# Altium project power.PrjPcb
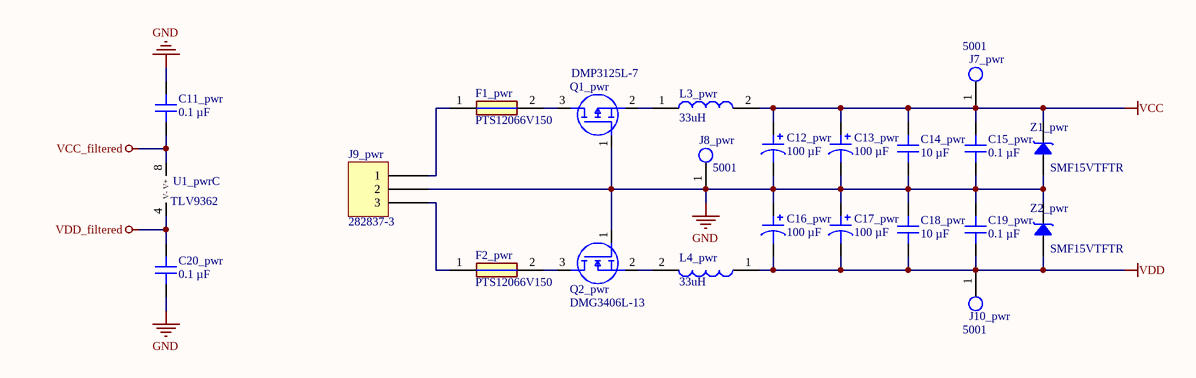
[diagram p0: misc.SchDoc]
2 sheets, 57 parts. Net scope: global (net labels, ports and power ports of the same name join across sheets).
Board file: power.PcbDoc
Sheets:
  misc.SchDoc
  LDO.SchDoc

## Sheet misc.SchDoc
size 381 x 241 mm; SheetNumber: 1; SheetTotal: 2

### Parts
C11_pwr  0.1 µF  [CAP 1206_3216 - 0.8MM]
C12_pwr  100 µF  [CAP ALSMD 8.3MM H10.5MM]
C13_pwr  100 µF  [CAP ALSMD 8.3MM H10.5MM]
C14_pwr  10 µF  [CAP 1206_3216 - 0.8MM]
C15_pwr  0.1 µF  [CAP 1206_3216 - 0.8MM]
C16_pwr  100 µF  [CAP ALSMD 8.3MM H10.5MM]
C17_pwr  100 µF  [CAP ALSMD 8.3MM H10.5MM]
C18_pwr  10 µF  [CAP 1206_3216 - 0.8MM]
C19_pwr  0.1 µF  [CAP 1206_3216 - 0.8MM]
C20_pwr  0.1 µF  [CAP 1206_3216 - 0.8MM]
F1_pwr  PTS12066V150  [FUSC3216X90N]
F2_pwr  PTS12066V150  [FUSC3216X90N]
J7_pwr  5001  [FP-5001-MFG]
J8_pwr  5001  [FP-5001-MFG]
J9_pwr  282837-3  [TE 282837-3]
J10_pwr  5001  [FP-5001-MFG]
L3_pwr  33uH  [INDPM116102X400N]
L4_pwr  33uH  [INDPM116102X400N]
Q1_pwr  DMP3125L-7  [SOT96P240X110-3N]
Q2_pwr  DMG3406L-13  [SOT96P240X110-3N]
U1_pwr  TLV9362  [SOIC8-127P600X175-8N]  (part C of 3)
Z1_pwr  SMF15VTFTR  [SMF15VTFTR]
Z2_pwr  SMF15VTFTR  [SMF15VTFTR]

### Nets
GND: C11_pwr.2 C12_pwr.2 C13_pwr.2 C14_pwr.1 C15_pwr.1 C16_pwr.1 C17_pwr.1 C18_pwr.2 C19_pwr.2 C20_pwr.1 J8_pwr.1 J9_pwr.2 Q1_pwr.1(G) Q2_pwr.1(G) Z1_pwr.2 Z2_pwr.1
VCC: C12_pwr.1 C13_pwr.1 C14_pwr.2 C15_pwr.2 J7_pwr.1 L3_pwr.2 Z1_pwr.1
VCC_filtered: C11_pwr.1 U1_pwr.8(V+)
VDD: C16_pwr.2 C17_pwr.2 C18_pwr.1 C19_pwr.1 J10_pwr.1 L4_pwr.1 Z2_pwr.2
VDD_filtered: C20_pwr.2 U1_pwr.4(V-)
NetF1_pwr_1: F1_pwr.1 J9_pwr.1
NetF1_pwr_2: F1_pwr.2 Q1_pwr.3(D)
NetF2_pwr_1: F2_pwr.1 J9_pwr.3
NetF2_pwr_2: F2_pwr.2 Q2_pwr.3(D)
NetL3_pwr_1: L3_pwr.1 Q1_pwr.2(S)
NetL4_pwr_2: L4_pwr.2 Q2_pwr.2(S)

### Library data of the parts
C11_pwr C15_pwr C19_pwr C20_pwr = 885012208087: CAP CER 0.1UF 50V X7R 1206; manufacturer: Würth Elektronik; Tolerance: ±10%; Part Number: 885012208087; Capacitance: 0.1 µF; Applications: General Purpose; componentlink1description: Datasheet; componentlink1url: https://katalog.we-online.de/pbs/datasheet/885012208087.pdf; componentlink2description: DigiKey Link; componentlink2url: https://www.digikey.com/en/products/detail/würth-elektronik/885012208087/5453982; Device Package: 1206 (3216 Metric); lastupdated: 6/4/2024 19:10:27; Lifecycle Status: Active; Minimum Order: 1; Mounting Type: Surface Mount, MLCC; Operating Temperature: -55°C ~ 125°C; Package / Case: 1206 (3216 Metric); packaging: TapeAndReel; partid: 20879; Part Status: Active; price: 0.06; series: WCAP-CSGP; Size / Dimension: 0.126" L x 0.063" W (3.20mm x 1.60mm); Supplier 1: DigiKey; Supplier Part Number 1: 732-8127-1-ND; Temperature Coefficient: X7R; Thickness (Max): 0.035" (0.90mm); value: 0.1 µF; Voltage - Rated: 50V
C12_pwr C13_pwr C16_pwr C17_pwr = 50TZV100M8X10.5: CAP ALUM 100UF 20% 50V SMD; manufacturer: Rubycon; Impedance: 340 mOhms; Lifetime @ Temp.: 2000 Hrs @ 105°C; Polarization: Polar; Ripple Current @ High Frequency: 350 mA @ 100 kHz; Ripple Current @ Low Frequency: 175 mA @ 120 Hz; Surface Mount Land Size: 0.327" L x 0.327" W (8.30mm x 8.30mm); Part Number: 50TZV100M8X10.5; Applications: Automotive; Capacitance: 100 µF; componentlink1description: Datasheet; componentlink1url: http://www.rubycon.co.jp/en/catalog/e_pdfs/aluminum/e_tzv.pdf; componentlink2description: DigiKey Link; componentlink2url: https://www.digikey.com/en/products/detail/rubycon/50TZV100M8X10-5/3134931; Device Package: Radial, Can - SMD; Height - Seated (Max): 0.413" (10.50mm); lastupdated: 6/3/2024 20:15:48; Lifecycle Status: Active; Minimum Order: 1; Mounting Type: Surface Mount; Operating Temperature: -55°C ~ 105°C; Package / Case: Radial, Can - SMD; packaging: TapeAndReel; partid: 7533; Part Status: Active; price: 0.16; Ratings: AEC-Q200; series: TZV; Size / Dimension: 0.315" Dia (8.00mm); Supplier 1: DigiKey; Supplier Part Number 1: 1189-1651-1-ND; Tolerance: ±20%; value: 100 µF; Voltage - Rated: 50 V
C14_pwr C18_pwr = 885012208069: CAP CER 10UF 25V X7R 1206; manufacturer: Würth Elektronik; Tolerance: ±10%; Part Number: 885012208069; Capacitance: 10 µF; Applications: General Purpose; componentlink1description: Datasheet; componentlink1url: https://katalog.we-online.de/pbs/datasheet/885012208069.pdf; componentlink2description: DigiKey Link; componentlink2url: https://www.digikey.com/en/products/detail/würth-elektronik/885012208069/5453429; Device Package: 1206 (3216 Metric); lastupdated: 6/4/2024 19:10:32; Lifecycle Status: Active; Minimum Order: 1; Mounting Type: Surface Mount, MLCC; Operating Temperature: -55°C ~ 125°C; Package / Case: 1206 (3216 Metric); packaging: TapeAndReel; partid: 43199; Part Status: Active; price: 0.40; series: WCAP-CSGP; Size / Dimension: 0.126" L x 0.063" W (3.20mm x 1.60mm); Supplier 1: DigiKey; Supplier Part Number 1: 732-7574-1-ND; Temperature Coefficient: X7R; Thickness (Max): 0.075" (1.90mm); value: 10 µF; Voltage - Rated: 25V
F1_pwr F2_pwr = PTS12066V150: Fuse; Manufacturer_Name: Eaton; Datasheet Link: https://in.element14.com/eaton-bussmann-series/pts120660v005/pptc-resettable-fuse-0-05a-60vdc/dp/2929344?srsltid=AfmBOorX1B25_1GKuczfUlW7ilxwoZgl3KmxHJmMFzJpoWYAJ50DmC3S; Height: 0.9mm; Manufacturer_Part_Number: PTS12066V150; Mouser Part Number: 504-PTS12066V150; Mouser Price/Stock: https://www.mouser.co.uk/ProductDetail/Eaton-Electronics/PTS120660V005?qs=QmibqUXyDhQPirhmCJ6OpQ%3D%3D; Arrow Part Number: PTS120660V005; Arrow Price/Stock: https://www.arrow.com/en/products/pts120660v005/eaton?region=europe
J7_pwr J8_pwr J10_pwr = CMP-2000-05181-2: PC TEST POINT MINIATURE BLACK; Body Material: Bronze; Plating: Silver; Inside Diameter: 1.27mm; Hole Diameter: 1.6mm; Number of Ports: 1; Outside Diameter: 2.54mm; Insulation: Insulated; Insulation Material: Nylon; Mount: Through Hole; RoHS Compliant: Yes; Series: THM; Height: 0.3inch; Termination: Through Hole; Material: Nylon; Packaging: Bulk; Contact Material: Bronze; REACH SVHC: No SVHC; Contact Plating: Silver; Orientation: Straight; Lead Free: Lead Free; Package Quantity: 100; Length: 7.62mm; Flammability Rating: UL94 V-0; Number of Contacts: 1; Diameter: 2.54mm; Housing Color: Black; Color: Black
J9_pwr = 282837-3: TERM BLK 3P SIDE ENT 5.08MM PCB; Manufacturer: TE Connectivity AMP Connectors; Current: 13.5 A; Mating Orientation: Horizontal with Board; Number of Levels: 1; Pitch: 0.200" (5.08mm); Positions Per Level: 3; Voltage: 300 V; Wire Gauge: 16-28 AWG; Wire Termination: Screw - Rising Cage Clamp; Part Number: 282837-3; Color: Green; ComponentLink1Description: Datasheet; ComponentLink1URL: https://www.te.com/commerce/DocumentDelivery/DDEController?Action=srchrtrv&DocNm=282837&DocType=Customer+Drawing&DocLang=English; ComponentLink2Description: DigiKey Link; ComponentLink2URL: https://www.digikey.com/en/products/detail/te-connectivity-amp-connectors/282837-3/2187974; Features: Interlocking (Side); LastUpdated: 6/21/2022 15:00:39; Lifecycle Status: Active; Minimum Order: 1; Mounting Type: Through Hole; Packaging: Tray; Part Status: Active; Price: 0.47; Series: Buchanan; Supplier 1: DigiKey; Supplier Part Number 1: A113321-ND
L3_pwr L4_pwr = AMRM00101040330MA1: Inductor; Manufacturer_Name: Pulse Electronics; Datasheet Link: https://productfinder.pulseelectronics.com/api/open/part-attachments/datasheet/amrm00101040330ma1; Height: 4mm; Manufacturer_Part_Number: AMRM00101040330MA1; Mouser Part Number: 673-AMRM101040330MA1; Mouser Price/Stock: https://www.mouser.co.uk/ProductDetail/Pulse-Electronics/AMRM00101040330MA1?qs=HoCaDK9Nz5eI6M5ad0CXDA%3D%3D; Value: 33uH
Q1_pwr = DMP3125L-7: MOSFET (P-Channel); Manufacturer_Name: Diodes Incorporated; Datasheet Link: https://www.diodes.com//assets/Datasheets/DMP3125L.pdf; Height: 1.1mm; Manufacturer_Part_Number: DMP3125L-7; Mouser Part Number: 621-DMP3125L-7; Mouser Price/Stock: https://www.mouser.co.uk/ProductDetail/Diodes-Incorporated/DMP3125L-7?qs=W0yvOO0ixfH8ma8MdHfXQA%3D%3D; Arrow Part Number: DMP3125L-7; Arrow Price/Stock: https://www.arrow.com/en/products/dmp3125l-7/diodes-incorporated?region=nac
Q2_pwr = DMG3406L-13: MOSFET (N-Channel); Manufacturer_Name: Diodes Incorporated; Datasheet Link: https://www.diodes.com//assets/Datasheets/DMG3406L.pdf; Height: 1.1mm; Manufacturer_Part_Number: DMG3406L-13; Mouser Part Number: 621-DMG3406L-13; Mouser Price/Stock: https://www.mouser.co.uk/ProductDetail/Diodes-Incorporated/DMG3406L-13?qs=BvpHGKeVh3r%252BRZTTCOfjpg%3D%3D; Arrow Part Number: DMG3406L-13; Arrow Price/Stock: https://www.arrow.com/en/products/dmg3406l-13/diodes-incorporated?region=nac
U1_pwr = TLV9362: TLV936x 10-MHz, 40-V, RRO, Operational Amplifie; ComponentLink1Description: Datasheet; ComponentLink1URL: https://www.ti.com/lit/ds/symlink/tlv9362.pdf
Z1_pwr Z2_pwr = SMF15VTFTR: Zener Diode; Manufacturer_Name: ROHM Semiconductor; Datasheet Link: https://fscdn.rohm.com/en/products/databook/datasheet/discrete/diode/zener/smf15vtftr-e.pdf; Height: 0.9mm; Manufacturer_Part_Number: SMF15VTFTR; Mouser Part Number: 755-SMF15VTFTR; Mouser Price/Stock: https://www.mouser.co.uk/ProductDetail/ROHM-Semiconductor/SMF15VTFTR?qs=HXFqYaX1Q2wU8NS9uLe0xg%3D%3D

## Sheet LDO.SchDoc
size 381 x 241 mm; SheetNumber: 2; SheetTotal: 2
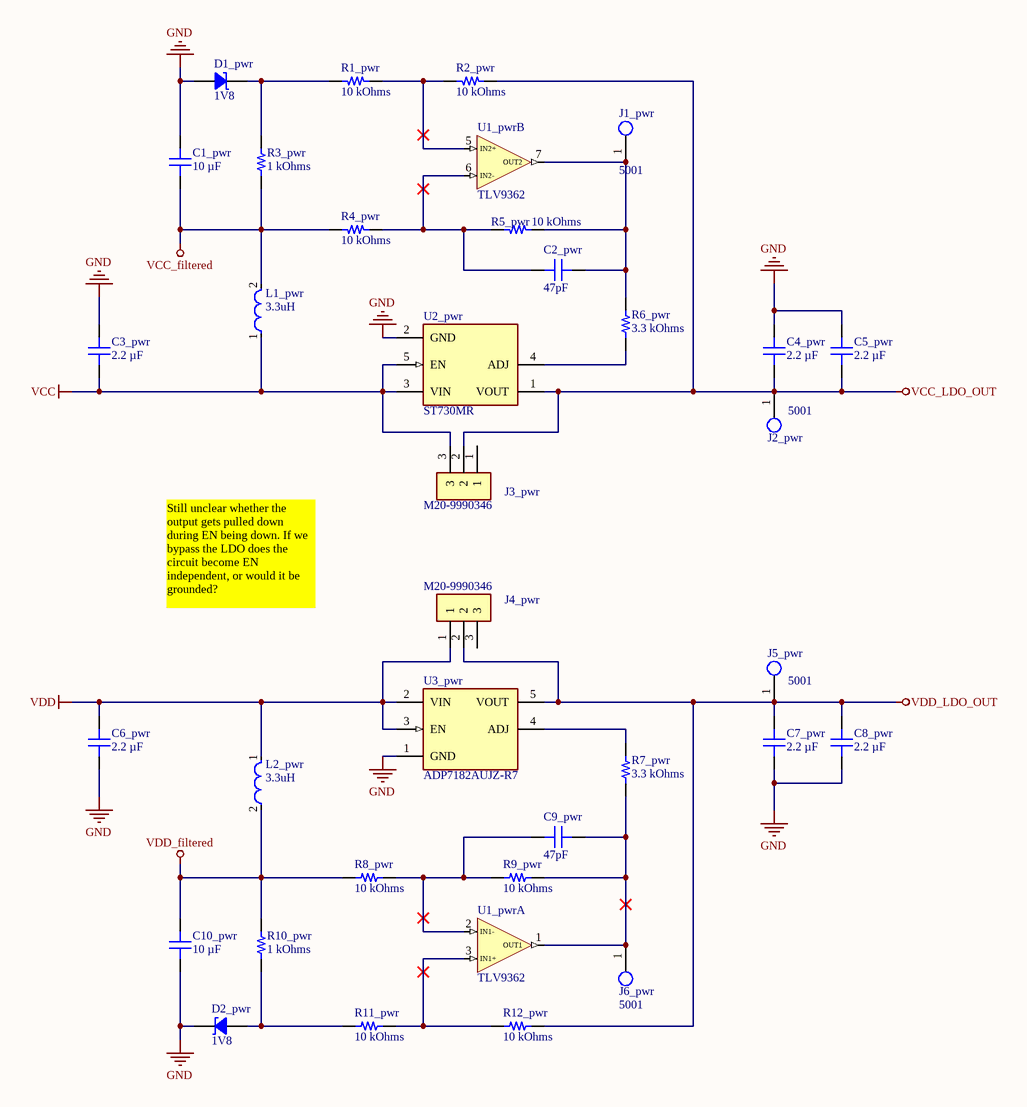
[diagram p1: LDO.SchDoc]

### Parts
C1_pwr  10 µF  [CAP 1206_3216 - 0.8MM]
C2_pwr  47pF  [CAP 1206_3216 - 1.8MM]
C3_pwr  2.2 µF  [CAP 1206_3216 - 0.8MM]
C4_pwr  2.2 µF  [CAP 1206_3216 - 0.8MM]
C5_pwr  2.2 µF  [CAP 1206_3216 - 0.8MM]
C6_pwr  2.2 µF  [CAP 1206_3216 - 0.8MM]
C7_pwr  2.2 µF  [CAP 1206_3216 - 0.8MM]
C8_pwr  2.2 µF  [CAP 1206_3216 - 0.8MM]
C9_pwr  47pF  [CAP 1206_3216 - 1.8MM]
C10_pwr  10 µF  [CAP 1206_3216 - 0.8MM]
D1_pwr  1V8  [SOD323]
D2_pwr  1V8  [SOD323]
J1_pwr  5001  [FP-5001-MFG]
J2_pwr  5001  [FP-5001-MFG]
J3_pwr  M20-9990346  [HDRV3W64P0X254_1X3_762X254X864P - duplicate]
J4_pwr  M20-9990346  [HDRV3W64P0X254_1X3_762X254X864P - duplicate]
J5_pwr  5001  [FP-5001-MFG]
J6_pwr  5001  [FP-5001-MFG]
L1_pwr  3.3uH  [FP-MLZ2012-1_25-IPC_B]
L2_pwr  3.3uH  [FP-MLZ2012-1_25-IPC_B]
R1_pwr  10 kOhms  [YAGEO RES 1206_3216]
R2_pwr  10 kOhms  [YAGEO RES 1206_3216]
R3_pwr  1 kOhms  [YAGEO RES 1206_3216]
R4_pwr  10 kOhms  [YAGEO RES 1206_3216]
R5_pwr  10 kOhms  [YAGEO RES 1206_3216]
R6_pwr  3.3 kOhms  [YAGEO RES 1206_3216]
R7_pwr  3.3 kOhms  [YAGEO RES 1206_3216]
R8_pwr  10 kOhms  [YAGEO RES 1206_3216]
R9_pwr  10 kOhms  [YAGEO RES 1206_3216]
R10_pwr  1 kOhms  [YAGEO RES 1206_3216]
R11_pwr  10 kOhms  [YAGEO RES 1206_3216]
R12_pwr  10 kOhms  [YAGEO RES 1206_3216]
U1_pwr  TLV9362  [SOIC8-127P600X175-8N]  (parts A,B of 3)
U2_pwr  ST730MR  [FP-UJ-5-IPC_B]
U3_pwr  ADP7182AUJZ-R7  [FP-UJ-5-IPC_B]

### Nets
GND: C1_pwr.1 C3_pwr.1 C4_pwr.1 C5_pwr.1 C6_pwr.1 C7_pwr.1 C8_pwr.1 C10_pwr.1 D1_pwr.1 D2_pwr.2 U2_pwr.2(GND) U3_pwr.1(GND)
VCC: C3_pwr.2 J3_pwr.3 L1_pwr.1 U2_pwr.3(VIN) U2_pwr.5(EN)
VCC_filtered: C1_pwr.2 L1_pwr.2 R3_pwr.1 R4_pwr.2
VCC_LDO_OUT: C4_pwr.2 C5_pwr.2 J2_pwr.1 J3_pwr.2 R2_pwr.1 U2_pwr.1(VOUT)
VDD: C6_pwr.2 J4_pwr.1 L2_pwr.1 U3_pwr.2(VIN) U3_pwr.3(EN)
VDD_filtered: C10_pwr.2 L2_pwr.2 R8_pwr.2 R10_pwr.2
VDD_LDO_OUT: C7_pwr.2 C8_pwr.2 J4_pwr.2 J5_pwr.1 R12_pwr.1 U3_pwr.5(VOUT)
NetC2_pwr_1: C2_pwr.1 R4_pwr.1 R5_pwr.2 U1_pwr.6(IN2-)
NetC2_pwr_2: C2_pwr.2 J1_pwr.1 R5_pwr.1 R6_pwr.1 U1_pwr.7(OUT2)
NetC9_pwr_1: C9_pwr.1 R8_pwr.1 R9_pwr.2 U1_pwr.2(IN1-)
NetC9_pwr_2: C9_pwr.2 J6_pwr.1 R7_pwr.2 R9_pwr.1 U1_pwr.1(OUT1)
NetD1_pwr_2: D1_pwr.2 R1_pwr.2 R3_pwr.2
NetD2_pwr_1: D2_pwr.1 R10_pwr.1 R11_pwr.2
NetR1_pwr_1: R1_pwr.1 R2_pwr.2 U1_pwr.5(IN2+)
NetR6_pwr_2: R6_pwr.2 U2_pwr.4(ADJ)
NetR7_pwr_1: R7_pwr.1 U3_pwr.4(ADJ)
NetR11_pwr_1: R11_pwr.1 R12_pwr.2 U1_pwr.3(IN1+)

Not connected (* = marked no-connect by the designer): J3_pwr 1; J4_pwr 3

### Notes on the sheet
- Still unclear whether the output gets pulled down during EN being down. If we bypass the LDO does the circuit become EN independent, or would it be grounded?
- Type @ to refer to a designator or a net

### Library data of the parts
C1_pwr C10_pwr = 885012208069: as C14_pwr on sheet misc; Part Number: 885012208069; Capacitance: 10 µF; Applications: General Purpose; componentlink1description: Datasheet; componentlink1url: https://katalog.we-online.de/pbs/datasheet/885012208069.pdf; componentlink2description: DigiKey Link; componentlink2url: https://www.digikey.com/en/products/detail/würth-elektronik/885012208069/5453429; Device Package: 1206 (3216 Metric); lastupdated: 6/4/2024 19:10:32; Lifecycle Status: Active; Minimum Order: 1; Mounting Type: Surface Mount, MLCC; Operating Temperature: -55°C ~ 125°C; Package / Case: 1206 (3216 Metric); packaging: TapeAndReel; partid: 43199; Part Status: Active; price: 0.40; series: WCAP-CSGP; Size / Dimension: 0.126" L x 0.063" W (3.20mm x 1.60mm); Supplier 1: DigiKey; Supplier Part Number 1: 732-7574-1-ND; Temperature Coefficient: X7R; Thickness (Max): 0.075" (1.90mm); value: 10 µF; Voltage - Rated: 25V
C2_pwr C9_pwr = 1206AA470KAT1A: CAP CER 47PF 1KV C0G/NP0 1206; manufacturer: AVX Corporation; Temperature Coefficient: C0G, NP0; Tolerance: ±10%; Voltage - Rated: 1000V (1kV); Part Number: 1206AA470KAT1A; Capacitance: 47pF; Applications: General Purpose; componentlink1description: Datasheet; componentlink1url: http://datasheets.avx.com/AVX-HV_MLCC.pdf; componentlink2description: DigiKey Link; componentlink2url: http://digikey.com/product-detail/en/avx-corporation/1206AA470KAT1A/478-2949-1-ND/808148; Device Package: 1206 (3216 Metric); Features: High Voltage; lastupdated: 9/2/2020 01:05:31; Lifecycle Status: Active; Minimum Order: 1; Mounting Type: Surface Mount, MLCC; Operating Temperature: -55°C ~ 125°C; Package / Case: 1206 (3216 Metric); packaging: TapeAndReel; partid: 21825; Part Status: Active; price: 0.11; series: -; Size / Dimension: 0.130" L x 0.063" W (3.30mm x 1.60mm); Supplier 1: DigiKey; Supplier Part Number 1: 478-2949-1-ND; Thickness (Max): 0.071" (1.80mm); value: 47pF
C3_pwr C4_pwr C5_pwr C6_pwr C7_pwr C8_pwr = 885382208001: CAP CER 2.2UF 25V X7R 1206; manufacturer: Würth Elektronik; Tolerance: ±10%; Part Number: 885382208001; Capacitance: 2.2 µF; Applications: Boardflex Sensitive; componentlink2description: DigiKey Link; componentlink2url: https://www.digikey.com/en/products/detail/würth-elektronik/885382208001/9816354; Device Package: 1206 (3216 Metric); Features: Soft Termination; lastupdated: 6/4/2024 19:10:38; Lifecycle Status: Active; Minimum Order: 1; Mounting Type: Surface Mount, MLCC; Operating Temperature: -55°C ~ 125°C; Package / Case: 1206 (3216 Metric); packaging: TapeAndReel; partid: 45904; Part Status: Active; price: 0.35; series: WCAP-CSST; Size / Dimension: 0.126" L x 0.063" W (3.20mm x 1.60mm); Supplier 1: DigiKey; Supplier Part Number 1: 732-13199-1-ND; Temperature Coefficient: X7R; Thickness (Max): 0.083" (2.10mm); value: 2.2 µF; Voltage - Rated: 25V
D1_pwr D2_pwr = BZX38450-C1V8X
J1_pwr J2_pwr J5_pwr J6_pwr = CMP-2000-05181-2: as J7_pwr on sheet misc; Insulation Material: Nylon; Mount: Through Hole; RoHS Compliant: Yes; Series: THM; Height: 0.3inch; Termination: Through Hole; Material: Nylon; Packaging: Bulk; Contact Material: Bronze; REACH SVHC: No SVHC; Contact Plating: Silver; Orientation: Straight; Lead Free: Lead Free; Package Quantity: 100; Length: 7.62mm; Flammability Rating: UL94 V-0; Number of Contacts: 1; Diameter: 2.54mm; Housing Color: Black; Color: Black
J3_pwr J4_pwr = M20-9990346: Connector; Manufacturer_Name: Harwin; Datasheet Link: https://cdn.harwin.com/pdfs/M20-999.pdf; Height: 8.64mm; Manufacturer_Part_Number: M20-9990346; Mouser Part Number: 855-M20-9990346; Mouser Price/Stock: https://www.mouser.co.uk/ProductDetail/Harwin/M20-9990346?qs=ulE8k0yEMYbyhQ3uXpFs8Q%3D%3D
L1_pwr L2_pwr = MLZ2012M: Shielded Multilayer Inductor 3.3uH ±20% 500mA 260mΩ SMD 0805; Saturation Current: 350mA; Core Material: Ferrite; DC Resistance (DCR): 260mR; RoHS Compliant: Yes; Mount: Surface Mount; Case Code (Metric): 2012; Case/Package: 0805; Min Operating Temperature: -55°C; Package Quantity: 2000; Shielding: Shielded; Current Rating: 500mA; Height - Seated (Max): 0.057inch; Case Code (Imperial): 0805; Width: 0.049inch; Tolerance: 20%; Packaging: Tape and Reel; Inductance: 3.3uH; Lead Free: Lead Free; Max Operating Temperature: 125°C; Length: 0.079inch; Value: 3.3uH
R1_pwr R2_pwr R4_pwr R5_pwr R8_pwr R9_pwr R11_pwr R12_pwr = RT1206FRE0710KL: RES SMD 10K OHM 1% 1/4W 1206; Manufacturer: Yageo; Power (Watts): 0.25W, 1/4W; Temperature Coefficient: ±50ppm/°C; Part Number: RT1206FRE0710KL; ComponentLink1Description: Datasheet; ComponentLink1URL: https://www.yageo.com/upload/media/product/productsearch/datasheet/rchip/PYu-RT_1-to-0.01_RoHS_L_11.pdf; ComponentLink2Description: DigiKey Link; ComponentLink2URL: https://www.digikey.com/en/products/detail/yageo/RT1206FRE0710KL/1082868; Composition: Thin Film; Device Package: 1206 (3216 Metric); Height - Seated (Max): 0.026" (0.65mm); LastUpdated: 7/25/2024 09:21:28; Lifecycle Status: Active; Minimum Order: 1; Number of Terminations: 2; Operating Temperature: -55°C ~ 155°C; Package / Case: 1206 (3216 Metric); Packaging: TapeAndReel; PartId: 38903; Part Status: Active; Price: 0.01; Resistance: 10 kOhms; Series: RT; Size / Dimension: 0.122" L x 0.063" W (3.10mm x 1.60mm); Supplier 1: DigiKey; Supplier Part Number 1: YAG1242CT-ND; Supplier Device Package: 1206; Tolerance: ±1%; Value: 10 kOhms
R3_pwr R10_pwr = RT1206FRE071KL: RES SMD 1K OHM 1% 1/4W 1206; Manufacturer: Yageo; Power (Watts): 0.25W, 1/4W; Temperature Coefficient: ±50ppm/°C; Part Number: RT1206FRE071KL; ComponentLink1Description: Datasheet; ComponentLink1URL: https://www.yageo.com/upload/media/product/productsearch/datasheet/rchip/PYu-RT_1-to-0.01_RoHS_L_11.pdf; ComponentLink2Description: DigiKey Link; ComponentLink2URL: https://www.digikey.com/en/products/detail/yageo/RT1206FRE071KL/1083016; Composition: Thin Film; Device Package: 1206 (3216 Metric); Height - Seated (Max): 0.026" (0.65mm); LastUpdated: 7/25/2024 09:21:27; Lifecycle Status: Active; Minimum Order: 1; Number of Terminations: 2; Operating Temperature: -55°C ~ 155°C; Package / Case: 1206 (3216 Metric); Packaging: TapeAndReel; PartId: 40465; Part Status: Active; Price: 0.01; Resistance: 1 kOhms; Series: RT; Size / Dimension: 0.122" L x 0.063" W (3.10mm x 1.60mm); Supplier 1: DigiKey; Supplier Part Number 1: YAG3366CT-ND; Supplier Device Package: 1206; Tolerance: ±1%; Value: 1 kOhms
R6_pwr R7_pwr = RT1206FRE073K3L: RES SMD 3.3K OHM 1% 1/4W 1206; Manufacturer: Yageo; Power (Watts): 0.25W, 1/4W; Temperature Coefficient: ±50ppm/°C; Part Number: RT1206FRE073K3L; ComponentLink1Description: Datasheet; ComponentLink1URL: https://www.yageo.com/upload/media/product/productsearch/datasheet/rchip/PYu-RT_1-to-0.01_RoHS_L_12.pdf; ComponentLink2Description: DigiKey Link; ComponentLink2URL: https://www.digikey.com/en/products/detail/yageo/RT1206FRE073K3L/1083187; Composition: Thin Film; Device Package: 1206 (3216 Metric); Height - Seated (Max): 0.026" (0.65mm); LastUpdated: 7/25/2024 09:21:22; Lifecycle Status: Active; Minimum Order: 1; Number of Terminations: 2; Operating Temperature: -55°C ~ 155°C; Package / Case: 1206 (3216 Metric); Packaging: TapeAndReel; PartId: 58380; Price: 0.01; Resistance: 3.3 kOhms; Series: RT; Size / Dimension: 0.122" L x 0.063" W (3.10mm x 1.60mm); Supplier 1: DigiKey; Supplier Part Number 1: 13-RT1206FRE073K3LCT-ND; Supplier Device Package: 1206; Tolerance: ±1%; Value: 3.3 kOhms; Part Status: Active
U1_pwr = TLV9362: as U1_pwr on sheet misc; ComponentLink1Description: Datasheet; ComponentLink1URL: https://www.ti.com/lit/ds/symlink/tlv9362.pdf
U3_pwr = ADP7182: IC REG LIN NEG ADJ 200MA 5TSOT; Manufacturer: Analog Devices; Number Of Outputs: 1; Min Supply Voltage: -2.7V; Max Junction Temp: +125°C; Dropout Voltage: -185mV; Output Current: -200mA; Max Supply Voltage: -28V; Output Voltage: -1.22/-27.815V; Nominal Supply Current: -33/-650uA; Output Type: AdjustableProgrammable; Accuracy Percentage: 1%; RoHS: TRUE; Ambient Temperature Range Low: -40°C; Digikey Description: IC REG LIN NEG ADJ 200MA 5TSOT; Device Class L3: Voltage Regulators - Linear; Ambient Temperature Range High: +85°C; Manufacturer Part Number: ADP7182AUJZ-R7; ComponentLink2URL: https://www.analog.com/media/en/technical-documentation/data-sheets/ADP7182.pdf; Ipc Land Pattern Name: SOT95P280X100-5; Temperature Range Low: -40°C; ComponentLink2Description: Datasheet; Mouser Description: LDO Regulator Neg -1.22V to -27V 0.2A 5-Pin TSOT T/R; Category: IC; Automotive: No; Device Class L1: Integrated Circuits (ICs); Temperature: -40°C to +125°C; Octopart: https://octopart.com/adp7182aujz-r7-analog+devices-21054665; Device Class L2: Power Management ICs; Height: 1mm; Package: UJ-5; Temperature Range High: +125°C; Lead Free: Yes

## Nets that join several sheets
GND: misc (16 pins), LDO (12 pins)
VCC: misc (7 pins), LDO (5 pins)
VCC_filtered: misc (C11_pwr.1 U1_pwr.8), LDO (C1_pwr.2 L1_pwr.2 R3_pwr.1 R4_pwr.2)
VDD: misc (7 pins), LDO (5 pins)
VDD_filtered: misc (C20_pwr.2 U1_pwr.4), LDO (C10_pwr.2 L2_pwr.2 R8_pwr.2 R10_pwr.2)